# EAGLE schematic Tracksoar v2 shield template (EAGLE 9.0.0)
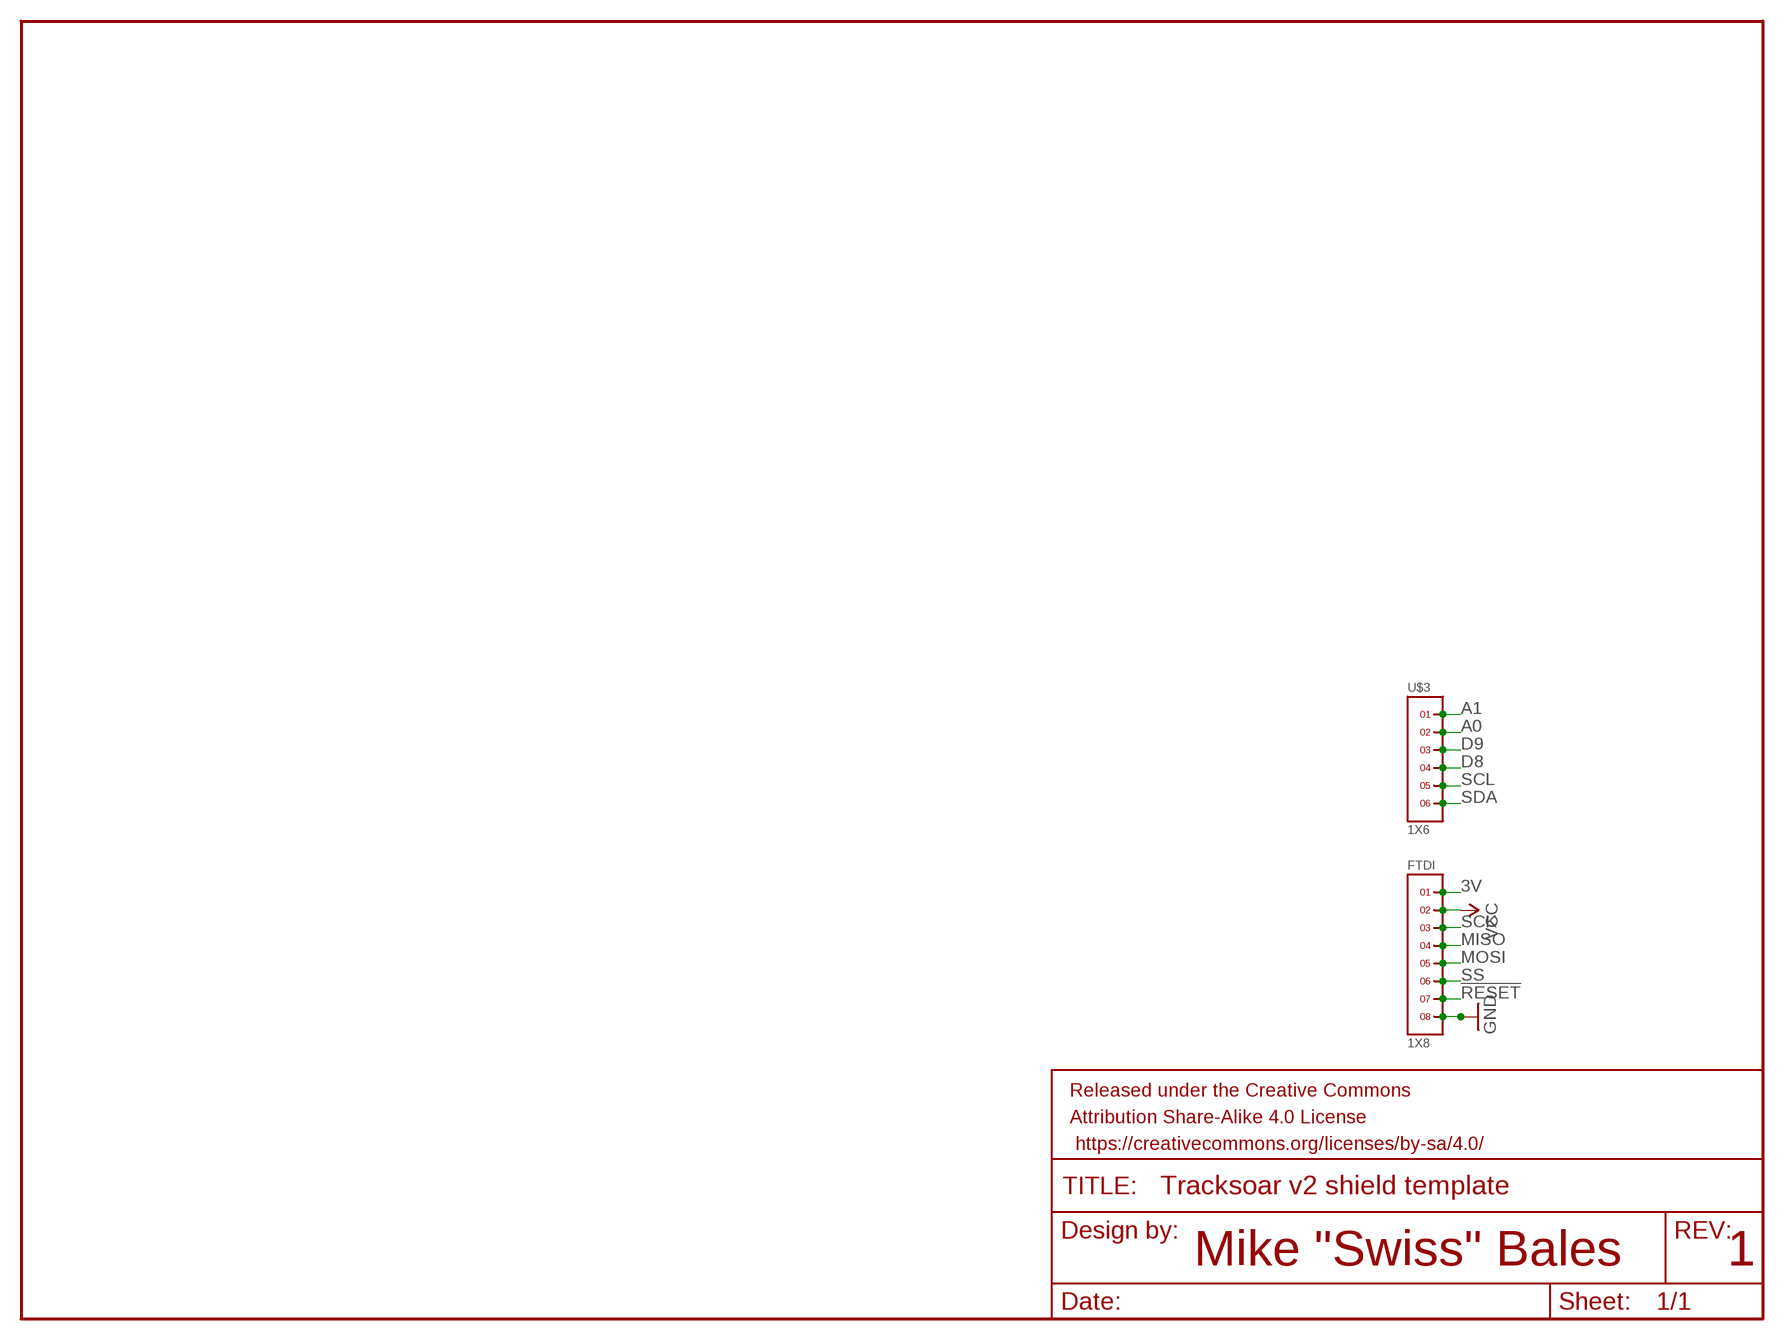
[diagram p0: schematic, sheet 1]

## Parts
FRAME1  FRAME-LETTER  [CREATIVE_COMMONS]
FTDI  1X8  [1X8]
U$3  1X6  [1X6]

## Nets
3V: FTDI.1
!RESET: FTDI.7
A0: U$3.2
A1: U$3.1
D8: U$3.4
D9: U$3.3
GND: FTDI.8
MISO: FTDI.4
MOSI: FTDI.5
SCK: FTDI.3
SCL: U$3.5
SDA: U$3.6
SS: FTDI.6
VCC: FTDI.2

## Notes on the sheet
- Mike "Swiss" Bales | 1

## Library data of the parts
FRAME1 = SparkFun-Aesthetics:FRAME-LETTER: Schematic Frame Standard 8.5x11 US Letter frame
FTDI = headers(2mm):1X8
U$3 = headers(2mm):1X6